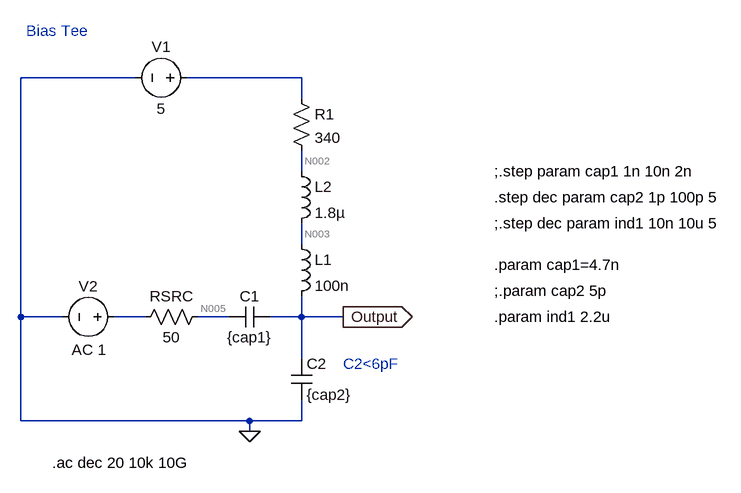
[diagram p0: schematic Bias-Tee_v3_AC.asc]
Bias-Tee_v3_AC.asc, the LTspice schematic file:
Version 4
SHEET 1 1028 680
WIRE 80 -128 -96 -128
WIRE 336 -128 160 -128
WIRE 336 -96 336 -128
WIRE 336 16 336 -16
WIRE 336 128 336 96
WIRE -96 240 -96 -128
WIRE -32 240 -96 240
WIRE 96 240 48 240
WIRE 224 240 176 240
WIRE 336 240 336 208
WIRE 336 240 288 240
WIRE 400 240 336 240
WIRE 336 304 336 240
WIRE -96 400 -96 240
WIRE 256 400 -96 400
WIRE 336 400 336 368
WIRE 336 400 256 400
WIRE 256 416 256 400
FLAG 256 416 0
FLAG 400 240 Output
IOPIN 400 240 Out
SYMBOL ind 320 112 R0
SYMATTR InstName L1
SYMATTR Value 100n
SYMBOL voltage 64 240 R90
WINDOW 0 -32 56 VBottom 2
WINDOW 3 32 56 VTop 2
WINDOW 123 35 55 VTop 2
WINDOW 39 0 0 Left 0
SYMATTR InstName V2
SYMATTR Value ""
SYMATTR Value2 AC 1
SYMBOL voltage 176 -128 R90
WINDOW 0 -32 56 VBottom 2
WINDOW 3 32 56 VTop 2
WINDOW 123 0 0 Left 0
WINDOW 39 0 0 Left 0
SYMATTR InstName V1
SYMATTR Value 5
SYMBOL res 192 224 R90
WINDOW 0 0 56 VBottom 2
WINDOW 3 32 56 VTop 2
SYMATTR InstName RSRC
SYMATTR Value 50
SYMBOL cap 288 224 R90
WINDOW 0 0 32 VBottom 2
WINDOW 3 32 32 VTop 2
SYMATTR InstName C1
SYMATTR Value {cap1}
SYMBOL cap 320 304 R0
SYMATTR InstName C2
SYMATTR Value {cap2}
SYMBOL ind 320 0 R0
SYMATTR InstName L2
SYMATTR Value 1.8µ
SYMBOL res 320 -112 R0
SYMATTR InstName R1
SYMATTR Value 340
TEXT -88 -200 Left 2 ;Bias Tee
TEXT -48 464 Left 2 !.ac dec 20 10k 10G
TEXT 632 16 Left 2 !;.step param cap1 1n 10n 2n
TEXT 632 96 Left 2 !;.step dec param ind1 10n 10u 5
TEXT 632 160 Left 2 !.param cap1=4.7n
TEXT 632 240 Left 2 !.param ind1 2.2u
TEXT 632 56 Left 2 !.step dec param cap2 1p 100p 5
TEXT 400 312 Left 2 ;C2<6pF
TEXT 632 200 Left 2 !;.param cap2 5p

The netlist it stands for:
* Bias-Tee_v3_AC.asc
L1 N003 Output 100n
V2 N004 0 AC 1
V1 N001 0 5
RSRC N005 N004 50
C1 Output N005 {cap1}
C2 Output 0 {cap2}
L2 N002 N003 1.8µ
R1 N001 N002 340
* Bias Tee
.ac dec 20 10k 10G
;.step param cap1 1n 10n 2n
;.step dec param ind1 10n 10u 5
.param cap1=4.7n
.param ind1 2.2u
.step dec param cap2 1p 100p 5
* C2<6pF
;.param cap2 5p
.backanno
.end

* Results of the author's LTspice run, read from the files saved beside the schematic
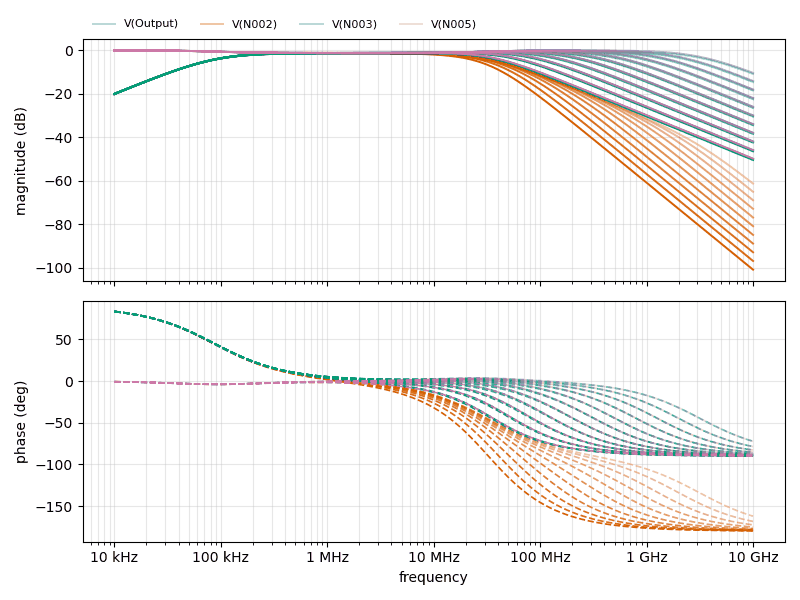
[diagram p1: AC Analysis of Bias-Tee_v3_AC.asc, plotted from the saved traces]
* AC Analysis, 11 runs:
*   V(Output) [run 1]: -20.02 dB at 10 kHz, -10.36 dB at 10 GHz, peak -0.03 dB at 223.9 MHz, 3 dB below the peak at 118.8 kHz and 3.209 GHz
*   V(Output) [run 2]: -20.02 dB at 10 kHz, -14.11 dB at 10 GHz, peak -0.05 dB at 177.8 MHz, 3 dB below the peak at 118 kHz and 2.034 GHz
*   V(Output) [run 3]: -20.02 dB at 10 kHz, -18.01 dB at 10 GHz, peak -0.08 dB at 141.3 MHz, 3 dB below the peak at 116.9 kHz and 1.293 GHz
*   V(Output) [run 4]: -20.02 dB at 10 kHz, -21.97 dB at 10 GHz, peak -0.13 dB at 112.2 MHz, 3 dB below the peak at 115.2 kHz and 825.5 MHz
*   V(Output) [run 5]: -20.02 dB at 10 kHz, -25.95 dB at 10 GHz, peak -0.20 dB at 89.13 MHz, 3 dB below the peak at 112.5 kHz and 530.2 MHz
*   V(Output) [run 6]: -20.02 dB at 10 kHz, -29.95 dB at 10 GHz, peak -0.31 dB at 63.1 MHz, 3 dB below the peak at 109.2 kHz and 343.5 MHz
*   V(Output) [run 7]: -20.02 dB at 10 kHz, -33.94 dB at 10 GHz, peak -0.46 dB at 50.12 MHz, 3 dB below the peak at 104.6 kHz and 225 MHz
*   V(Output) [run 8]: -20.02 dB at 10 kHz, -37.94 dB at 10 GHz, peak -0.68 dB at 35.48 MHz, 3 dB below the peak at 98.67 kHz and 148.8 MHz
*   V(N002) [run 1]: -20.02 dB at 10 kHz, -61.27 dB at 10 GHz, peak -1.19 dB at 1.778 MHz, 3 dB below the peak at 86.69 kHz and 32.75 MHz
*   V(N002) [run 2]: -20.02 dB at 10 kHz, -65.02 dB at 10 GHz, peak -1.19 dB at 1.778 MHz, 3 dB below the peak at 86.68 kHz and 32.77 MHz
*   V(N002) [run 3]: -20.02 dB at 10 kHz, -68.92 dB at 10 GHz, peak -1.20 dB at 1.778 MHz, 3 dB below the peak at 86.67 kHz and 32.79 MHz
*   V(N002) [run 4]: -20.02 dB at 10 kHz, -72.88 dB at 10 GHz, peak -1.20 dB at 1.778 MHz, 3 dB below the peak at 86.65 kHz and 32.82 MHz
*   V(N002) [run 5]: -20.02 dB at 10 kHz, -76.86 dB at 10 GHz, peak -1.20 dB at 1.778 MHz, 3 dB below the peak at 86.62 kHz and 32.85 MHz
*   V(N002) [run 6]: -20.02 dB at 10 kHz, -80.86 dB at 10 GHz, peak -1.21 dB at 1.778 MHz, 3 dB below the peak at 86.57 kHz and 32.81 MHz
*   V(N002) [run 7]: -20.02 dB at 10 kHz, -84.85 dB at 10 GHz, peak -1.21 dB at 1.778 MHz, 3 dB below the peak at 86.49 kHz and 32.6 MHz
*   V(N002) [run 8]: -20.02 dB at 10 kHz, -88.85 dB at 10 GHz, peak -1.23 dB at 1.778 MHz, 3 dB below the peak at 86.36 kHz and 31.94 MHz
*   V(N003) [run 1]: -20.02 dB at 10 kHz, -10.83 dB at 10 GHz, peak -0.49 dB at 199.5 MHz, 3 dB below the peak at 103.3 kHz and 3.202 GHz
*   V(N003) [run 2]: -20.02 dB at 10 kHz, -14.58 dB at 10 GHz, peak -0.51 dB at 158.5 MHz, 3 dB below the peak at 102.9 kHz and 2.028 GHz
*   V(N003) [run 3]: -20.02 dB at 10 kHz, -18.48 dB at 10 GHz, peak -0.53 dB at 125.9 MHz, 3 dB below the peak at 102.3 kHz and 1.287 GHz
*   V(N003) [run 4]: -20.02 dB at 10 kHz, -22.44 dB at 10 GHz, peak -0.56 dB at 100 MHz, 3 dB below the peak at 101.4 kHz and 819.4 MHz
*   V(N003) [run 5]: -20.02 dB at 10 kHz, -26.42 dB at 10 GHz, peak -0.62 dB at 79.43 MHz, 3 dB below the peak at 99.91 kHz and 524.1 MHz
*   V(N003) [run 6]: -20.02 dB at 10 kHz, -30.42 dB at 10 GHz, peak -0.69 dB at 56.23 MHz, 3 dB below the peak at 98.07 kHz and 337.5 MHz
*   V(N003) [run 7]: -20.02 dB at 10 kHz, -34.41 dB at 10 GHz, peak -0.80 dB at 44.67 MHz, 3 dB below the peak at 95.5 kHz and 219.2 MHz
*   V(N003) [run 8]: -20.02 dB at 10 kHz, -38.41 dB at 10 GHz, peak -0.95 dB at 31.62 MHz, 3 dB below the peak at 92.17 kHz and 143.6 MHz
*   V(N005) [run 1]: -0.01 dB at 10 kHz, -10.36 dB at 10 GHz, peak -0.01 dB at 10 kHz, 3 dB below the peak at 3.196 GHz
*   V(N005) [run 2]: -0.01 dB at 10 kHz, -14.11 dB at 10 GHz, peak -0.01 dB at 10 kHz, 3 dB below the peak at 2.018 GHz
*   V(N005) [run 3]: -0.01 dB at 10 kHz, -18.01 dB at 10 GHz, peak -0.01 dB at 10 kHz, 3 dB below the peak at 1.275 GHz
*   V(N005) [run 4]: -0.01 dB at 10 kHz, -21.96 dB at 10 GHz, peak -0.01 dB at 10 kHz, 3 dB below the peak at 806.2 MHz
*   V(N005) [run 5]: -0.01 dB at 10 kHz, -25.94 dB at 10 GHz, peak -0.01 dB at 10 kHz, 3 dB below the peak at 510.2 MHz
*   V(N005) [run 6]: -0.01 dB at 10 kHz, -29.93 dB at 10 GHz, peak -0.01 dB at 10 kHz, 3 dB below the peak at 323.4 MHz
*   V(N005) [run 7]: -0.01 dB at 10 kHz, -33.92 dB at 10 GHz, peak -0.01 dB at 10 kHz, 3 dB below the peak at 205.3 MHz
*   V(N005) [run 8]: -0.01 dB at 10 kHz, -37.90 dB at 10 GHz, peak -0.01 dB at 10 kHz, 3 dB below the peak at 130.6 MHz